# Altium schematic sheet Output.SchDoc
size A; SheetNumber: 5; SheetTotal: 6
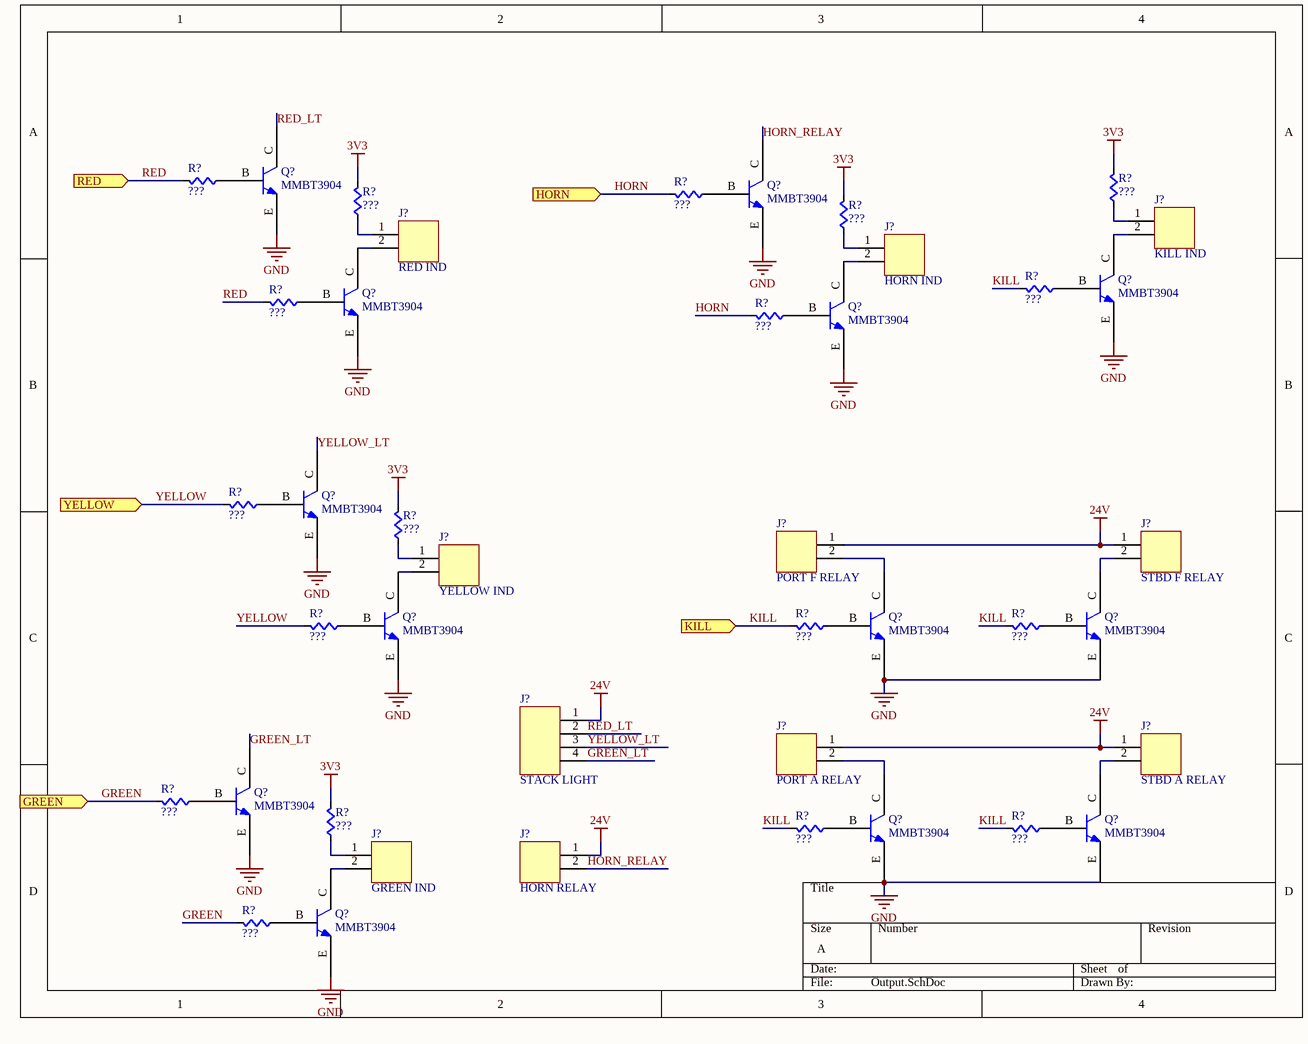
[diagram p0: Output.SchDoc]

## Parts
(Parts that share a designator on the sheet are numbered #1, #2 ... from top to bottom, then left to right.)
J?#1  KILL IND  [MOLEX-HDR-1X2-SHERLOCK-VERT]
J?#2  RED IND  [MOLEX-HDR-1X2-SHERLOCK-VERT]
J?#3  HORN IND  [MOLEX-HDR-1X2-SHERLOCK-VERT]
J?#4  PORT F RELAY  [MOLEX-HDR-1X2-SHERLOCK-VERT]
J?#5  STBD F RELAY  [MOLEX-HDR-1X2-SHERLOCK-VERT]
J?#6  YELLOW IND  [MOLEX-HDR-1X2-SHERLOCK-VERT]
J?#7  STACK LIGHT  [MOLEX-HDR-1X4-SHERLOCK-VERT]
J?#8  PORT A RELAY  [MOLEX-HDR-1X2-SHERLOCK-VERT]
J?#9  STBD A RELAY  [MOLEX-HDR-1X2-SHERLOCK-VERT]
J?#10  GREEN IND  [MOLEX-HDR-1X2-SHERLOCK-VERT]
J?#11  HORN RELAY  [MOLEX-HDR-1X2-SHERLOCK-VERT]
Q?#1  MMBT3904  [MMBT3904]
Q?#2  MMBT3904  [MMBT3904]
Q?#3  MMBT3904  [MMBT3904]
Q?#4  MMBT3904  [MMBT3904]
Q?#5  MMBT3904  [MMBT3904]
Q?#6  MMBT3904  [MMBT3904]
Q?#7  MMBT3904  [MMBT3904]
Q?#8  MMBT3904  [MMBT3904]
Q?#9  MMBT3904  [MMBT3904]
Q?#10  MMBT3904  [MMBT3904]
Q?#11  MMBT3904  [MMBT3904]
Q?#12  MMBT3904  [MMBT3904]
Q?#13  MMBT3904  [MMBT3904]
R?#1  value ???  [RES0603]  (hidden comment: Res)
R?#2  value ???  [RES0603]  (hidden comment: Res)
R?#3  value ???  [RES0603]  (hidden comment: Res)
R?#4  value ???  [RES0603]  (hidden comment: Res)
R?#5  value ???  [RES0603]  (hidden comment: Res)
R?#6  value ???  [RES0603]  (hidden comment: Res)
R?#7  value ???  [RES0603]  (hidden comment: Res)
R?#8  value ???  [RES0603]  (hidden comment: Res)
R?#9  value ???  [RES0603]  (hidden comment: Res)
R?#10  value ???  [RES0603]  (hidden comment: Res)
R?#11  value ???  [RES0603]  (hidden comment: Res)
R?#12  value ???  [RES0603]  (hidden comment: Res)
R?#13  value ???  [RES0603]  (hidden comment: Res)
R?#14  value ???  [RES0603]  (hidden comment: Res)
R?#15  value ???  [RES0603]  (hidden comment: Res)
R?#16  value ???  [RES0603]  (hidden comment: Res)
R?#17  value ???  [RES0603]  (hidden comment: Res)
R?#18  value ???  [RES0603]  (hidden comment: Res)

## Ports
GREEN (in), HORN (in), KILL (in), RED (in), YELLOW (in)

## Nets
3V3: R?#2.1(A) R?#4.1(A) R?#5.1(A) R?#10.1(A) R?#15.1(A)
24V: J?#4.1 J?#5.1 J?#7.1 J?#8.1 J?#9.1 J?#11.1
GND: Q?#1.E Q?#2.E Q?#3.E Q?#4.E Q?#5.E Q?#6.E Q?#7.E Q?#8.E Q?#9.E Q?#10.E Q?#11.E Q?#12.E Q?#13.E
GREEN: R?#14.1(A) R?#18.1(A) ; port GREEN
GREEN_LT: J?#7.4 Q?#10.C
HORN: R?#3.1(A) R?#8.1(A) ; port HORN
HORN_RELAY: J?#11.2 Q?#2.C
KILL: R?#6.1(A) R?#12.1(A) R?#13.1(A) R?#16.1(A) R?#17.1(A) ; port KILL
RED: R?#1.1(A) R?#7.1(A) ; port RED
RED_LT: J?#7.2 Q?#1.C
YELLOW: R?#9.1(A) R?#11.1(A) ; port YELLOW
YELLOW_LT: J?#7.3 Q?#6.C
NetJ?#1_1: J?#1.1 R?#2.2(B)
NetJ?#1_2: J?#1.2 Q?#3.C
NetJ?#2_1: J?#2.1 R?#4.2(B)
NetJ?#2_2: J?#2.2 Q?#4.C
NetJ?#3_1: J?#3.1 R?#5.2(B)
NetJ?#3_2: J?#3.2 Q?#5.C
NetJ?#4_2: J?#4.2 Q?#8.C
NetJ?#5_2: J?#5.2 Q?#9.C
NetJ?#6_1: J?#6.1 R?#10.2(B)
NetJ?#6_2: J?#6.2 Q?#7.C
NetJ?#8_2: J?#8.2 Q?#11.C
NetJ?#9_2: J?#9.2 Q?#12.C
NetJ?#10_1: J?#10.1 R?#15.2(B)
NetJ?#10_2: J?#10.2 Q?#13.C
NetQ?#1_B: Q?#1.B R?#1.2(B)
NetQ?#2_B: Q?#2.B R?#3.2(B)
NetQ?#3_B: Q?#3.B R?#6.2(B)
NetQ?#4_B: Q?#4.B R?#7.2(B)
NetQ?#5_B: Q?#5.B R?#8.2(B)
NetQ?#6_B: Q?#6.B R?#9.2(B)
NetQ?#7_B: Q?#7.B R?#11.2(B)
NetQ?#8_B: Q?#8.B R?#12.2(B)
NetQ?#9_B: Q?#9.B R?#13.2(B)
NetQ?#10_B: Q?#10.B R?#14.2(B)
NetQ?#11_B: Q?#11.B R?#16.2(B)
NetQ?#12_B: Q?#12.B R?#17.2(B)
NetQ?#13_B: Q?#13.B R?#18.2(B)

## Library data of the parts
J?#1-J?#6 J?#8-J?#11 = MOLEX-HDR-1x2-SHERLOCK_VERT: Header, Molex, 2mm Pitch Sherlock Header, Single Row, Vertical, 2 Circuits, Length 3.3mm, 0353620250; Manufacturer Part Number: *; Order Part Number: *
J?#7 = MOLEX-HDR-1x4-SHERLOCK_VERT: Header, Molex, 2mm Pitch Sherlock Header, Single Row, Vertical, 4 Circuits, Length 3.3mm, 0353620450; Manufacturer Part Number: *; Order Part Number: *
Q?#1-Q?#13 = MMBT3904: TRANS NPN 40V 0.2A SOT-23; Manufacturer 1: Fairchild Semiconductor; Supplier 1: Digi-Key; Supplier Part Number 1: MMBT3904FSCT-ND; Manufacturer Part Number 1: MMBT3904
R?#1-R?#18 = Res: Supplier 1: Digi-Key; Supplier Part Number 1: RMCF0603JT10K0CT-ND